# Altium project TTFT_3.0_tiny.PrjPCB
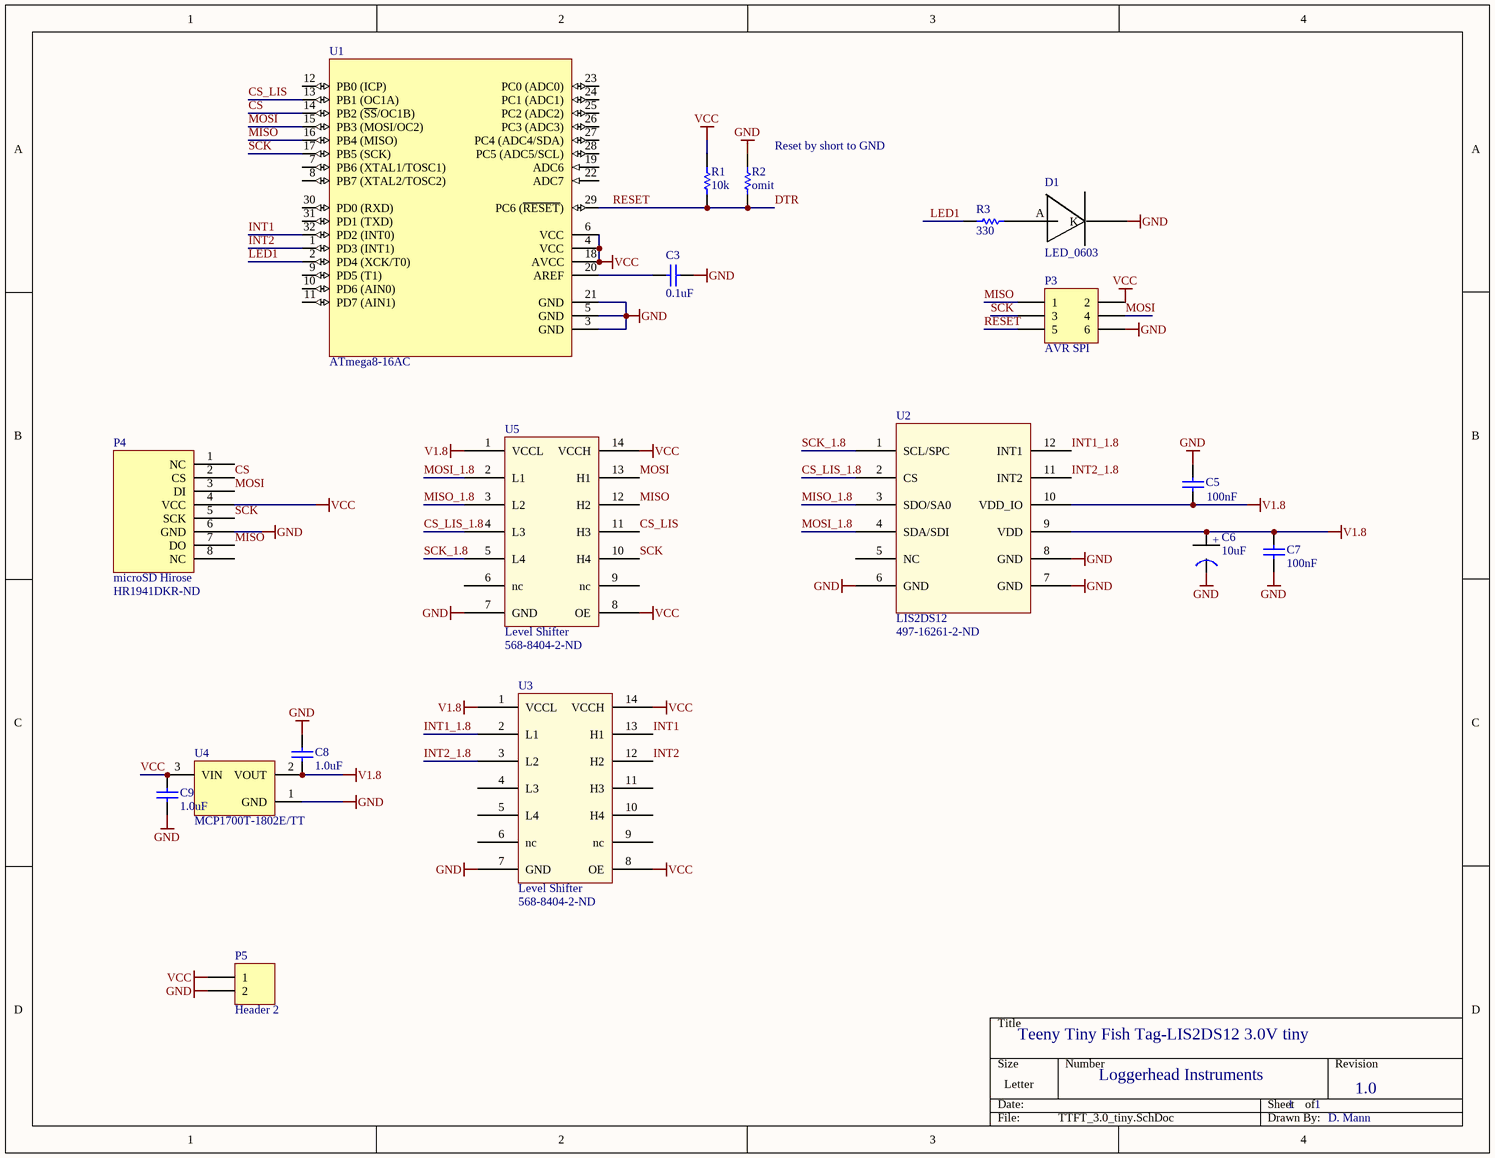
[diagram p0: TTFT_3.0_tiny.SchDoc]
1 sheet, 18 parts. Net scope: global (net labels, ports and power ports of the same name join across sheets).
Board file: TTFT_3.0_tiny.PcbDoc

## Sheet TTFT_3.0_tiny.SchDoc
size Letter

### Parts
C3  0.1uF  [0402]
C5  100nF  [0402]
C6  10uF  [Tant0805]
C7  100nF  [0402]
C8  1.0uF  [0402]
C9  1.0uF  [0402]
D1  LED_0603  [Diode0603]
P3  AVR SPI  [HDR2X3]
P4  microSD Hirose  Supplier Part Number 1: HR1941DKR-ND  [DM3D microSD]
P5  Header 2  [HDR1X2]
R1  10k  [3-0603]
R2  omit  [3-0603]
R3  330  [3-0603]
U1  ATmega8-16AC  [32M1-A_M]
U2  LIS2DS12  Supplier Part Number 1: 497-16261-2-ND  [LGA-12]
U3  Level Shifter  Supplier Part Number 1: 568-8404-2-ND  [DHVQFN14]
U4  MCP1700T-1802E/TT  [SOT-23-TT3_N]
U5  Level Shifter  Supplier Part Number 1: 568-8404-2-ND  [DHVQFN14]

### Nets
GND: C3.2 C5.2 C6.1(GND) C7.2 C8.2 C9.2 D1.K P3.6 P4.6(GND) P5.2 R2.2 U1.3(GND) U1.5(GND) U1.21(GND) U2.6(GND) U2.7(GND) U2.8(GND) U3.7(GND) U4.1(GND) U5.7(GND)
V1.8: C5.1 C6.2(+) C7.1 C8.1 U2.9(VDD) U2.10(VDD_IO) U3.1(VCCL) U4.2(VOUT) U5.1(VCCL)
VCC: C9.1 P3.2 P4.4(VCC) P5.1 R1.2 U1.4(VCC) U1.6(VCC) U1.18(AVCC) U3.8(OE) U3.14(VCCH) U4.3(VIN) U5.8(OE) U5.14(VCCH)
CS: P4.2(CS) U1.14(PB2_(~{SS}/OC1B))
CS_LIS: U1.13(PB1_(OC1A)) U5.11(H3)
CS_LIS_1.8: U2.2(CS) U5.4(L3)
DTR: P3.5 R1.1 R2.1 U1.29(PC6_(~{RESET}))  [also labelled RESET]
INT1: U1.32(PD2_(INT0)) U3.13(H1)
INT1_1.8: U2.12(INT1) U3.2(L1)
INT2: U1.1(PD3_(INT1)) U3.12(H2)
INT2_1.8: U2.11(INT2) U3.3(L2)
LED1: R3.1 U1.2(PD4_(XCK/T0))
MISO: P3.1 P4.7(DO) U1.16(PB4_(MISO)) U5.12(H2)
MISO_1.8: U2.3(SDO/SA0) U5.3(L2)
MOSI: P3.4 P4.3(DI) U1.15(PB3_(MOSI/OC2)) U5.13(H1)
MOSI_1.8: U2.4(SDA/SDI) U5.2(L1)
SCK: P3.3 P4.5(SCK) U1.17(PB5_(SCK)) U5.10(H4)
SCK_1.8: U2.1(SCL/SPC) U5.5(L4)
NetC3_1: C3.1 U1.20(AREF)
NetD1_A: D1.A R3.2

Not connected (* = marked no-connect by the designer): P4 1(NC) 8(NC); U1 7(PB6_(XTAL1/TOSC1)) 8(PB7_(XTAL2/TOSC2)) 9(PD5_(T1)) 10(PD6_(AIN0)) 11(PD7_(AIN1)) 12(PB0_(ICP)) 19(ADC6) 22(ADC7) 23(PC0_(ADC0)) 24(PC1_(ADC1)) 25(PC2_(ADC2)) 26(PC3_(ADC3)) 27(PC4_(ADC4/SDA)) 28(PC5_(ADC5/SCL)) 30(PD0_(RXD)) 31(PD1_(TXD)); U2 5(NC); U3 4(L3) 5(L4) 6(nc) 9(nc) 10(H4) 11(H3); U5 6(nc) 9(nc)

### Notes on the sheet
- (near R2) Reset by short to GND
- Teeny Tiny Fish Tag-LIS2DS12 3.0V tiny
- Loggerhead Instruments
- 1
- 1.0
- D. Mann

### Library data of the parts
C3 = C0402: Ceramic Chip Capacitor - Standard; Note: Footprint corresponds to dimensions for bulk cassette packaging. This case size has tightened tolerances.; Published: 17-Jul-2002; LatestRevisionDate: 19-Mar-2004; LatestRevisionNote: Silkscreen size reduced.; DatasheetDocument: Mar-2001; PackageDocument: Mar-2001; PackageReference: 0402; Publisher: Altium Limited; Code_JEITA: 0402; Code_IPC: 1005 [0402]; ComponentLink1Description: Manufacturer Link; ComponentLink1URL: http://www.kemet.com/; ComponentLink2Description: Datasheet; ComponentLink2URL: http://www.kemet.com/kemet/web/homepage/kechome.nsf/vapubfilesname/F3102TA.pdf/$file/F3102TA.pdf; Value: 0.1uF
C5 C7 = C0402: Ceramic Chip Capacitor - Standard; Note: Footprint corresponds to dimensions for bulk cassette packaging. This case size has tightened tolerances.; Value: 100pF; Published: 17-Jul-2002; LatestRevisionDate: 19-Mar-2004; LatestRevisionNote: Silkscreen size reduced.; DatasheetDocument: Mar-2001; PackageDocument: Mar-2001; PackageReference: 0402; Publisher: Altium Limited; Code_JEITA: 0402; Code_IPC: 1005 [0402]; ComponentLink1Description: Manufacturer Link; ComponentLink1URL: http://www.kemet.com/; ComponentLink2Description: Datasheet; ComponentLink2URL: http://www.kemet.com/kemet/web/homepage/kechome.nsf/vapubfilesname/F3102TA.pdf/$file/F3102TA.pdf
C6 = Tant0805: Value: 10uF
C8 C9 = C0402: Ceramic Chip Capacitor - Standard; Note: Footprint corresponds to dimensions for bulk cassette packaging. This case size has tightened tolerances.; Value: 0.1uF; Published: 17-Jul-2002; LatestRevisionDate: 19-Mar-2004; LatestRevisionNote: Silkscreen size reduced.; DatasheetDocument: Mar-2001; PackageDocument: Mar-2001; PackageReference: 0402; Publisher: Altium Limited; Code_JEITA: 0402; Code_IPC: 1005 [0402]; ComponentLink1Description: Manufacturer Link; ComponentLink1URL: http://www.kemet.com/; ComponentLink2Description: Datasheet; ComponentLink2URL: http://www.kemet.com/kemet/web/homepage/kechome.nsf/vapubfilesname/F3102TA.pdf/$file/F3102TA.pdf
P3 = Header 3X2: Header, 3-Pin, Dual row; LatestRevisionDate: 17-Jul-2002; LatestRevisionNote: Re-released for DXP Platform.; Publisher: Altium Limited
P5 = Header 2: Header, 2-Pin; LatestRevisionDate: 17-Jul-2002; LatestRevisionNote: Re-released for DXP Platform.; Publisher: Altium Limited
R1-R3 = ERJ3RK: Precision Thick Film Chip Resistor, 10 Ohm to 1M Ohm Range, 1% and 0.5% Tolerance, 0603 Size, 0.063 W; Published: 17-Dec-2003; LatestRevisionDate: 19-Mar-2004; LatestRevisionNote: Silkscreen size reduced.; PackageDocument: Mar-2003; PackageReference: 3-0603; Publisher: Altium Limited; Code_IPC: 1608 [0603]; ComponentLink1Description: Manufacturer Link; ComponentLink1URL: http://www.panasonic.com/industrial/components/resistive_products.htm; ComponentLink2Description: Datasheet; ComponentLink2URL: http://www.panasonic.com/industrial/components/pdf/AOA0000CE2.pdf
U1 = ATmega8-16AC: 8-Bit AVR Microcontroller with 8K Bytes of In-System Programmable Flash Memory; Published: 17-Sep-2003; LatestRevisionDate: 13-Apr-2006; LatestRevisionNote: IPC-7351 Footprint Added.; DatasheetVersion: 2486H-AVR-09/02; PackageVersion: revB, Oct-2001; PackageReference: 32A; Publisher: Altium Limited; PackageDescription: 32-Pin Thin Quad Flat Pack 0.8 mm Pitch; Code_JEDEC: MS-026-ABA; ComponentLink1Description: Manufacturer Link; ComponentLink1URL: http://www.atmel.com; ComponentLink2Description: Datasheet; ComponentLink2URL: http://www.atmel.com/dyn/resources/prod_documents/doc2486.pdf
U3 U5 = NTB0104: Voltage level translator; Supplier 1: Digi-Key
U4 = MCP1700T-1802E/TT: Low Quiescent Current LDO, 3-Pin SOT-23, Extended Temperature, Tape and Reel; Manufacturer: Microchip; DatasheetVersion: revB, Feb-2007; PackageVersion: revBB, Aug-2009; PackageReference: SOT-23-TT3; PackageDescription: 3-Lead Plastic Small Outline Transistor (TT) [SOT-23]; Supplier 1: Digi-Key; Supplier Part Number 1: MCP1700T1802ETTTR-ND; Supplier 2: Digi-Key; Supplier Part Number 2: MCP1700T1802ETTCT-ND; Supplier 3: Digi-Key; Supplier Part Number 3: MCP1700T1802ETTDKR-ND; Supplier 4: Farnell; Supplier Part Number 4: 1296591RL; Supplier 5: Farnell; Supplier Part Number 5: 1296591; Supplier 6: Newark; Supplier Part Number 6: 84R5175; Supplier 7: Mouser; Supplier Part Number 7: 579-MCP1700T1802E/TT; Mounting Technology: Surface Mount; Code_IPC: SOT23-3; PartNumber: MCP1700T-1802E/TT; ComponentLink1Description: Manufacturer URL; ComponentLink1URL: http://www.microchip.com/; ComponentLink2Description: Datasheet; ComponentLink2URL: http://ww1.microchip.com/downloads/en/DeviceDoc/21826b.pdf; ComponentLink3Description: Package Specification; ComponentLink3URL: http://www.microchip.com/stellent/groups/techpub_sg/documents/packagingspec/en012702.pdf
P4 = microSD Hirose: Supplier 1: Digi-Key
U2 = LIS2DS12: Supplier 1: Digi-Key